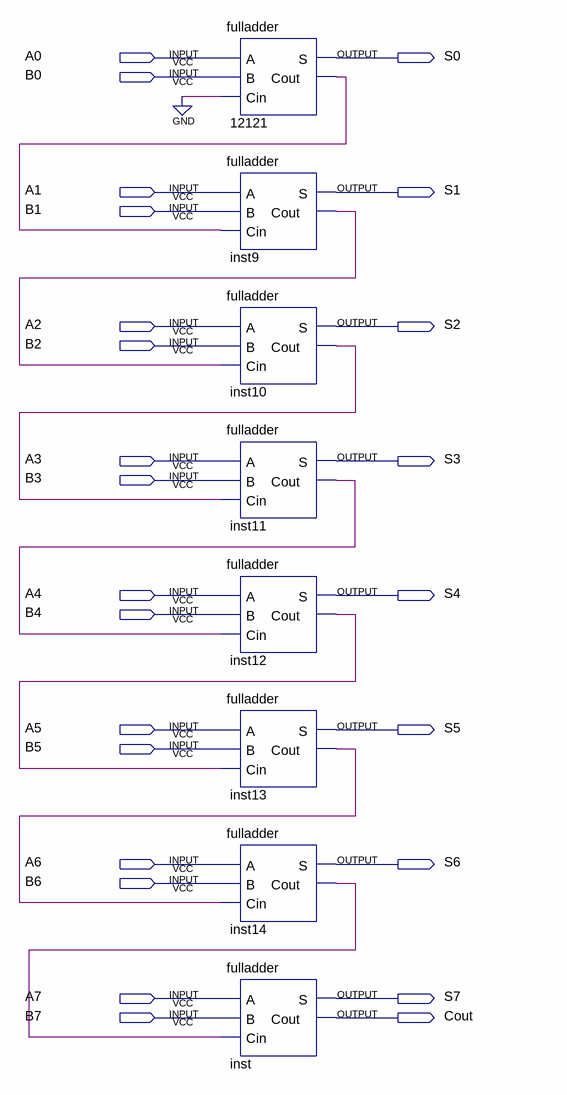
[diagram p0: schematic sheet]
// Quartus schematic somador.bdf as structural Verilog: 8 symbols, 25 pins
module somador (
  input  A0,
  input  B0,
  input  A1,
  input  B1,
  input  A2,
  input  B2,
  input  A3,
  input  B3,
  input  A4,
  input  B4,
  input  A5,
  input  B5,
  input  A6,
  input  B6,
  input  A7,
  input  B7,
  output S0,
  output S1,
  output S2,
  output S3,
  output S4,
  output S5,
  output S6,
  output S7,
  output Cout
);

  wire inst9_cout, inst10_cout, inst11_cout, inst12_cout, inst13_cout, inst14_cout, n12121_cout;

  fulladder u_12121 (.A(A0), .B(B0), .Cin(1'b0), .S(S0), .Cout(n12121_cout));
  fulladder inst9 (.A(A1), .B(B1), .Cin(n12121_cout), .S(S1), .Cout(inst9_cout));
  fulladder inst10 (.A(A2), .B(B2), .Cin(inst9_cout), .S(S2), .Cout(inst10_cout));
  fulladder inst11 (.A(A3), .B(B3), .Cin(inst10_cout), .S(S3), .Cout(inst11_cout));
  fulladder inst12 (.A(A4), .B(B4), .Cin(inst11_cout), .S(S4), .Cout(inst12_cout));
  fulladder inst13 (.A(A5), .B(B5), .Cin(inst12_cout), .S(S5), .Cout(inst13_cout));
  fulladder inst14 (.A(A6), .B(B6), .Cin(inst13_cout), .S(S6), .Cout(inst14_cout));
  fulladder inst (.A(A7), .B(B7), .Cin(inst14_cout), .S(S7), .Cout(Cout));
endmodule
